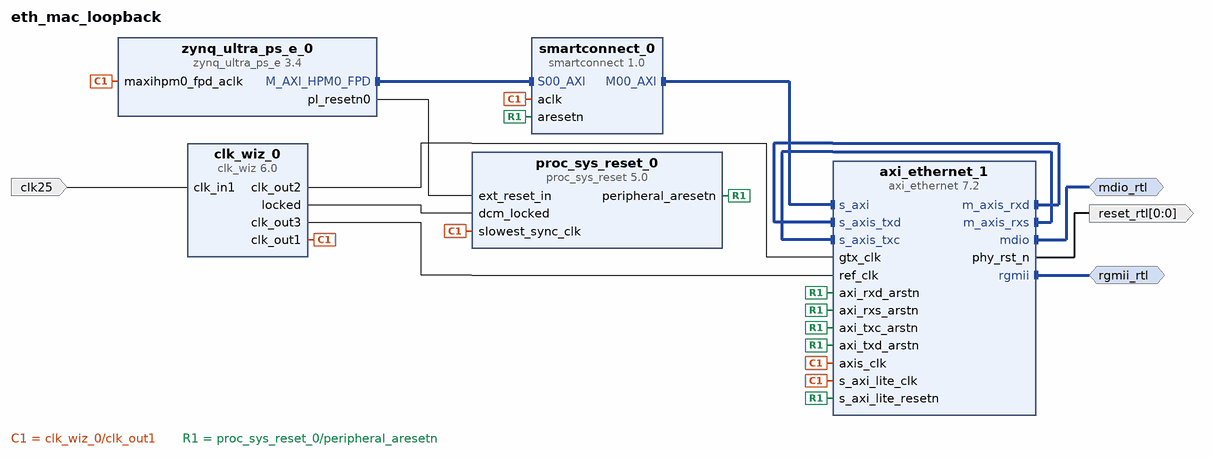
[diagram p0: block diagram of the top level]
# Vivado block design eth_mac_loopback, xck26-sfvc784-2LV-c, Vivado 2022.2
create_bd_design eth_mac_loopback

create_bd_intf_port -mode Master -vlnv xilinx.com:interface:mdio_rtl:1.0 mdio_rtl
create_bd_intf_port -mode Master -vlnv xilinx.com:interface:rgmii_rtl:1.0 rgmii_rtl
create_bd_port -dir O -from 0 -to 0 -type rst reset_rtl
set_property -dict {CONFIG.POLARITY ACTIVE_LOW} [get_bd_ports reset_rtl]
create_bd_port -dir I -type clk clk25
set_property -dict {CONFIG.FREQ_HZ 25000000} [get_bd_ports clk25]

create_bd_cell -type ip -vlnv xilinx.com:ip:zynq_ultra_ps_e:3.4 zynq_ultra_ps_e_0
set_property -dict [list \
  CONFIG.PSU__DDR_HIGH_ADDRESS_GUI_ENABLE 0 \
  CONFIG.PSU__MAXIGP0__DATA_WIDTH 128 \
  CONFIG.PSU__USE__M_AXI_GP0 1 \
  CONFIG.PSU__USE__M_AXI_GP2 0 \
] [get_bd_cells zynq_ultra_ps_e_0]
# 29 more settings of zynq_ultra_ps_e_0 are not shown: defaults, MIO pin electricals, DDR timing, and values the tool derives
create_bd_cell -type ip -vlnv xilinx.com:ip:proc_sys_reset:5.0 proc_sys_reset_0
create_bd_cell -type ip -vlnv xilinx.com:ip:smartconnect:1.0 smartconnect_0
create_bd_cell -type ip -vlnv xilinx.com:ip:clk_wiz:6.0 clk_wiz_0
set_property -dict [list \
  CONFIG.CLKIN1_JITTER_PS 400.0 \
  CONFIG.CLKOUT1_JITTER 226.966 \
  CONFIG.CLKOUT1_PHASE_ERROR 237.727 \
  CONFIG.CLKOUT1_REQUESTED_OUT_FREQ 100 \
  CONFIG.CLKOUT2_JITTER 220.126 \
  CONFIG.CLKOUT2_PHASE_ERROR 237.727 \
  CONFIG.CLKOUT2_REQUESTED_OUT_FREQ 125 \
  CONFIG.CLKOUT2_USED true \
  CONFIG.CLKOUT3_JITTER 193.101 \
  CONFIG.CLKOUT3_PHASE_ERROR 237.727 \
  CONFIG.CLKOUT3_REQUESTED_OUT_FREQ 333.333 \
  CONFIG.CLKOUT3_USED true \
  CONFIG.MMCM_CLKFBOUT_MULT_F 40.000 \
  CONFIG.MMCM_CLKIN1_PERIOD 40.000 \
  CONFIG.MMCM_CLKIN2_PERIOD 10.0 \
  CONFIG.MMCM_CLKOUT0_DIVIDE_F 10.000 \
  CONFIG.MMCM_CLKOUT1_DIVIDE 8 \
  CONFIG.MMCM_CLKOUT2_DIVIDE 3 \
  CONFIG.MMCM_DIVCLK_DIVIDE 1 \
  CONFIG.NUM_OUT_CLKS 3 \
  CONFIG.PRIM_IN_FREQ 25 \
  CONFIG.RESET_PORT resetn \
  CONFIG.RESET_TYPE ACTIVE_LOW \
  CONFIG.USE_RESET false \
] [get_bd_cells clk_wiz_0]
create_bd_cell -type ip -vlnv xilinx.com:ip:axi_ethernet:7.2 axi_ethernet_1
set_property -dict {CONFIG.PHY_TYPE RGMII} [get_bd_cells axi_ethernet_1]

# ---- connections ----

connect_bd_intf_net [get_bd_intf_pins axi_ethernet_1/m_axis_rxd] [get_bd_intf_pins axi_ethernet_1/s_axis_txd]
connect_bd_intf_net [get_bd_intf_pins axi_ethernet_1/m_axis_rxs] [get_bd_intf_pins axi_ethernet_1/s_axis_txc]
connect_bd_intf_net [get_bd_intf_ports mdio_rtl] [get_bd_intf_pins axi_ethernet_1/mdio]
connect_bd_intf_net [get_bd_intf_ports rgmii_rtl] [get_bd_intf_pins axi_ethernet_1/rgmii]
connect_bd_intf_net [get_bd_intf_pins axi_ethernet_1/s_axi] [get_bd_intf_pins smartconnect_0/M00_AXI]
connect_bd_intf_net [get_bd_intf_pins zynq_ultra_ps_e_0/M_AXI_HPM0_FPD] [get_bd_intf_pins smartconnect_0/S00_AXI]
connect_bd_net [get_bd_pins axi_ethernet_1/phy_rst_n] [get_bd_ports reset_rtl]
connect_bd_net -net clk25_1 [get_bd_ports clk25] [get_bd_pins clk_wiz_0/clk_in1]
connect_bd_net [get_bd_pins clk_wiz_0/clk_out1] \
  [get_bd_pins zynq_ultra_ps_e_0/maxihpm0_fpd_aclk] [get_bd_pins smartconnect_0/aclk] \
  [get_bd_pins proc_sys_reset_0/slowest_sync_clk] [get_bd_pins axi_ethernet_1/s_axi_lite_clk] \
  [get_bd_pins axi_ethernet_1/axis_clk]
connect_bd_net [get_bd_pins clk_wiz_0/clk_out2] [get_bd_pins axi_ethernet_1/gtx_clk]
connect_bd_net [get_bd_pins clk_wiz_0/clk_out3] [get_bd_pins axi_ethernet_1/ref_clk]
connect_bd_net [get_bd_pins clk_wiz_0/locked] [get_bd_pins proc_sys_reset_0/dcm_locked]
connect_bd_net [get_bd_pins proc_sys_reset_0/peripheral_aresetn] \
  [get_bd_pins smartconnect_0/aresetn] [get_bd_pins axi_ethernet_1/s_axi_lite_resetn] \
  [get_bd_pins axi_ethernet_1/axi_txd_arstn] [get_bd_pins axi_ethernet_1/axi_txc_arstn] \
  [get_bd_pins axi_ethernet_1/axi_rxd_arstn] [get_bd_pins axi_ethernet_1/axi_rxs_arstn]
connect_bd_net [get_bd_pins zynq_ultra_ps_e_0/pl_resetn0] [get_bd_pins proc_sys_reset_0/ext_reset_in]

# ---- address map ----
assign_bd_address -offset 0x00A0000000 -range 256K -target_address_space [get_bd_addr_spaces zynq_ultra_ps_e_0/Data] [get_bd_addr_segs axi_ethernet_1/s_axi/Reg0]

validate_bd_design
save_bd_design
